# Altium schematic sheet WL-RF-BPF.SchDoc
size A2 portrait; Address1: Address1; Address2: Address2; Address3: Address3; Address4: Address4; DocumentNumber: WOLF-RF_UNIT; SheetNumber: 2; Scale: 1:1; DocumentType: Схема электрическая принципиальная; FirstReferrence: АБВГ.123456.001
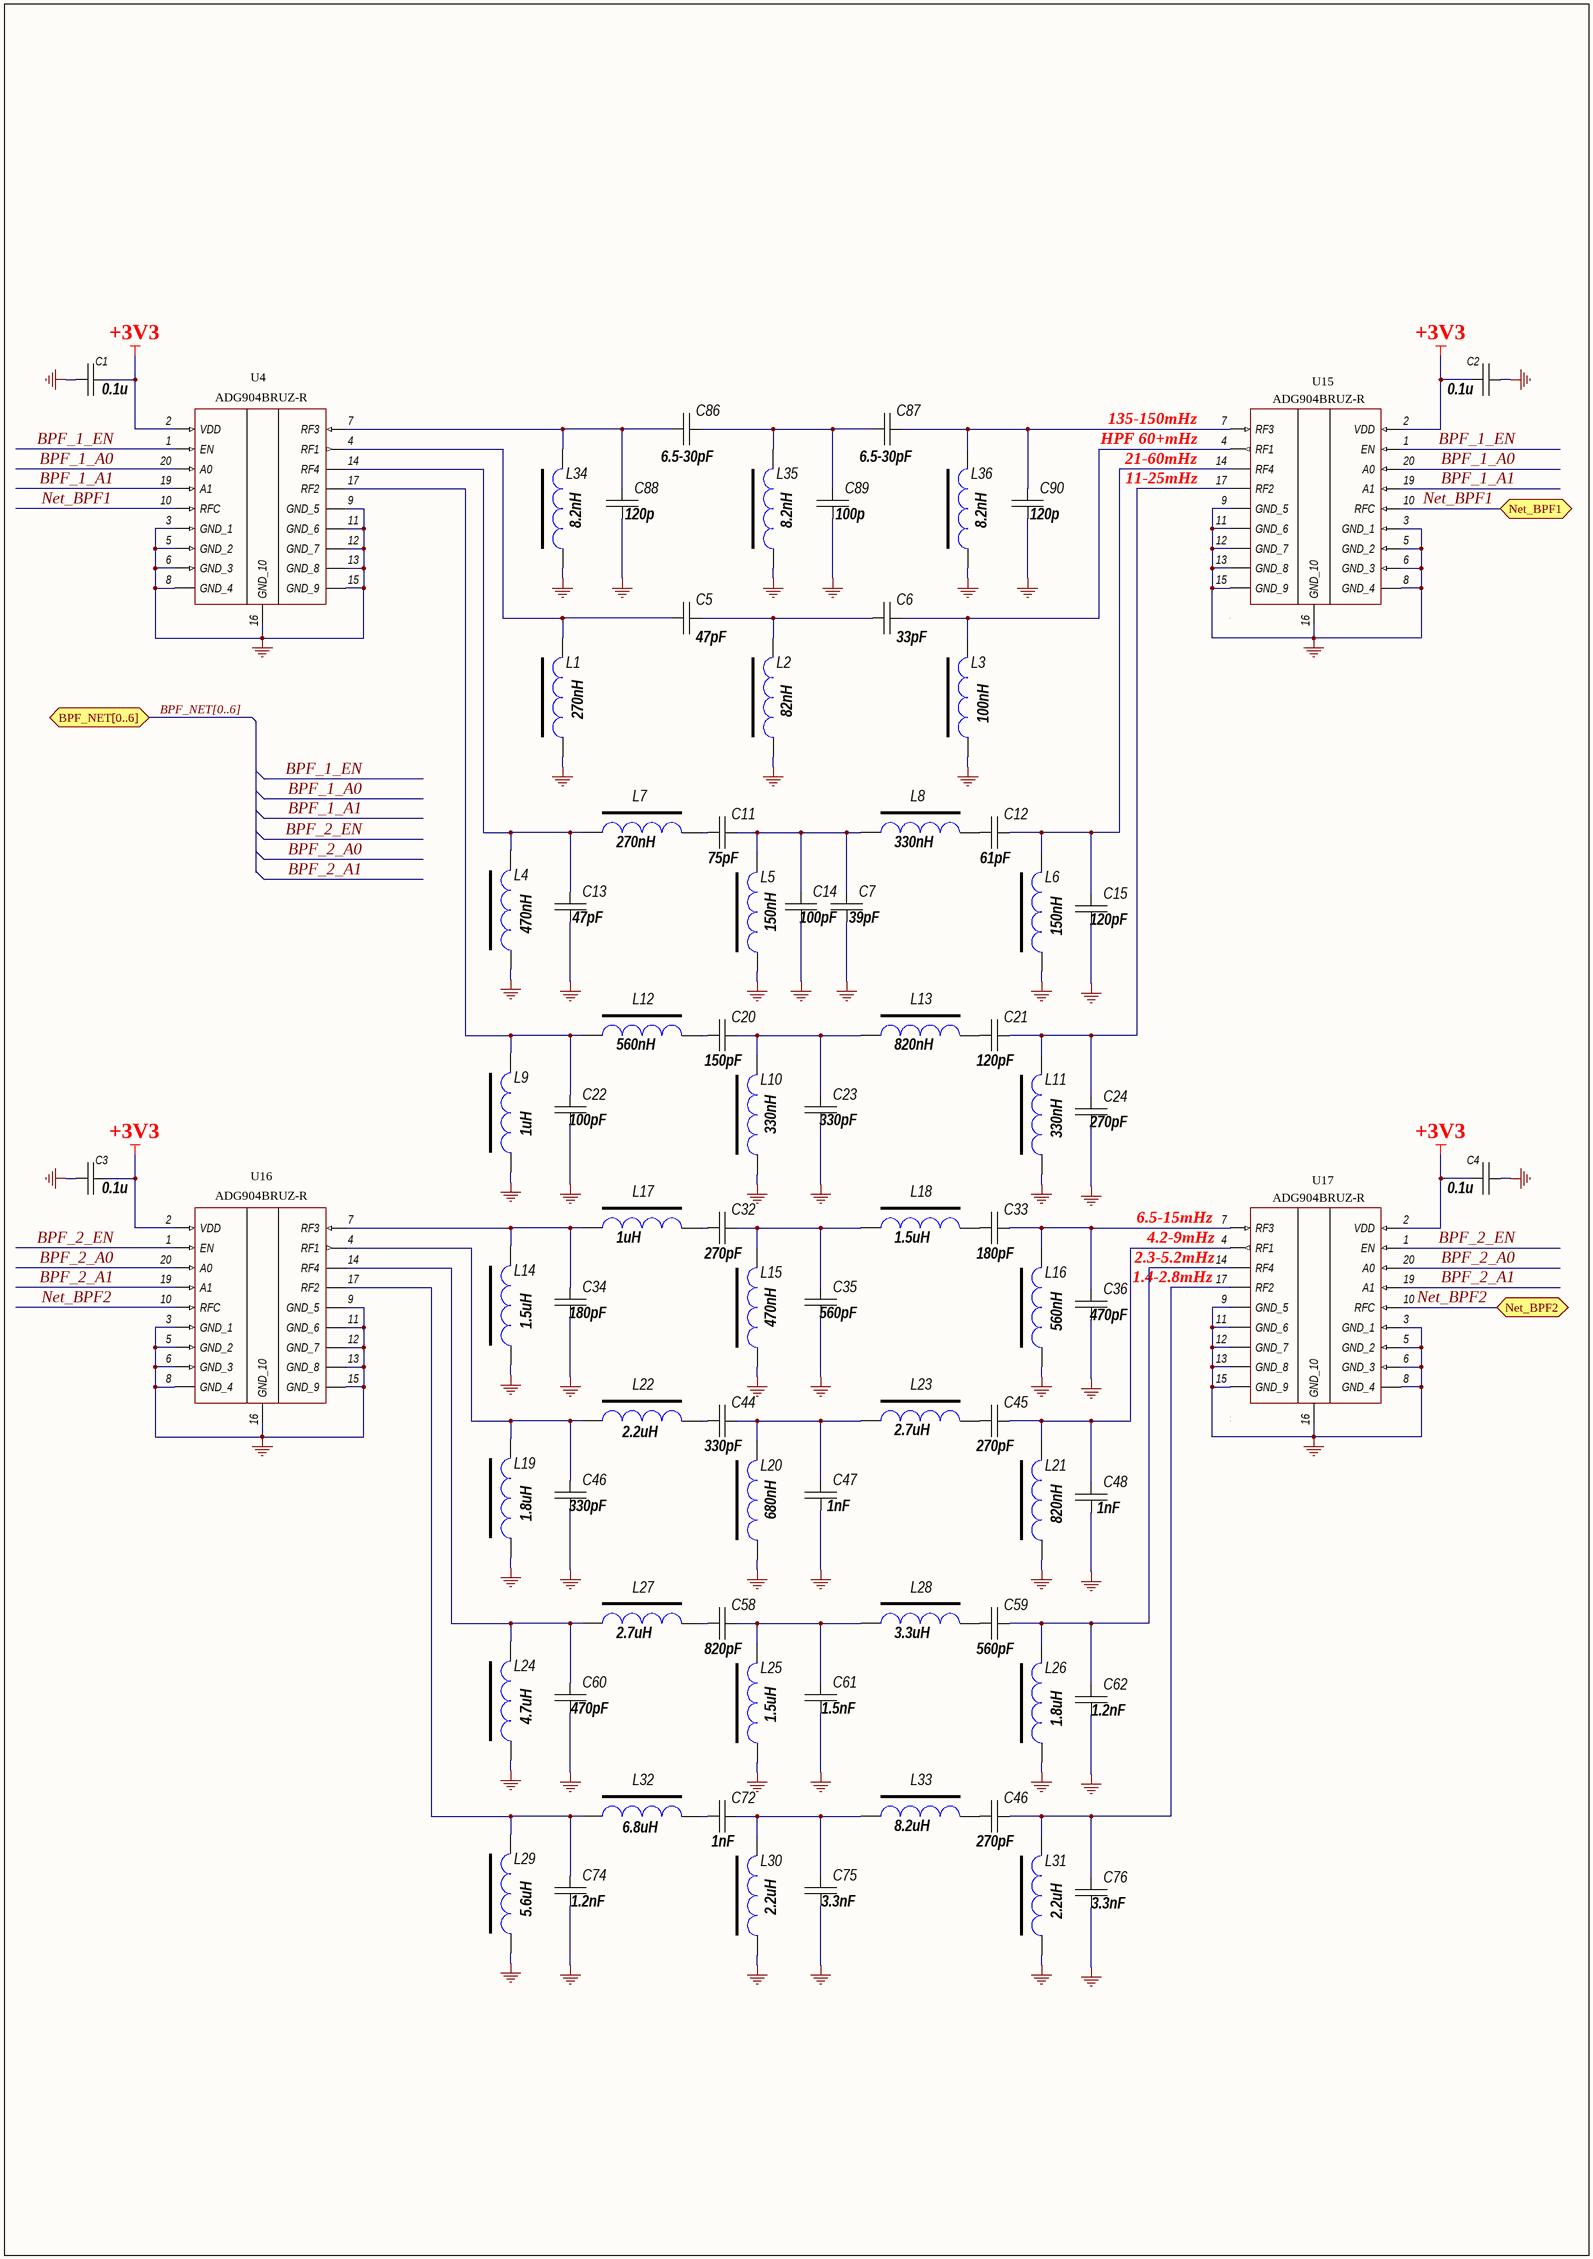
[diagram p0: WL-RF-BPF.SchDoc]

## Parts
(Parts that share a designator on the sheet are numbered #1, #2 ... from top to bottom, then left to right.)
C1  0.1u  [CH0201C]
C2  0.1u  [CH0201C]
C3  0.1u  [CH0201C]
C4  0.1u  [CH0201C]
C5  47pF  [CH0805C]
C6  33pF  [CH0805C]
C7  39pF  [CH0805C]
C11  75pF  [CH0805C]
C12  61pF  [CH0805C]
C13  47pF  [CH0805C]
C14  100pF  [CH0805C]
C15  120pF  [CH0805C]
C20  150pF  [CH0805C]
C21  120pF  [CH0805C]
C22  100pF  [CH0805C]
C23  330pF  [CH0805C]
C24  270pF  [CH0805C]
C32  270pF  [CH0805C]
C33  180pF  [CH0805C]
C34  180pF  [CH0805C]
C35  560pF  [CH0805C]
C36  470pF  [CH0805C]
C44  330pF  [CH0805C]
C45  270pF  [CH0805C]
C46#1  330pF  [CH0805C]
C46#2  270pF  [CH0805C]
C47  1nF  [CH0805C]
C48  1nF  [CH0805C]
C58  820pF  [CH0805C]
C59  560pF  [CH0805C]
C60  470pF  [CH0805C]
C61  1.5nF  [CH0805C]
C62  1.2nF  [CH0805C]
C72  1nF  [CH0805C]
C74  1.2nF  [CH0805C]
C75  3.3nF  [CH0805C]
C76  3.3nF  [CH0805C]
C86  6.5-30pF  [CH0805C]
C87  6.5-30pF  [CH0805C]
C88  120p  [CH0805C]
C89  100p  [CH0805C]
C90  120p  [CH0805C]
L1  270nH  [L1210]
L2  82nH  [L1210]
L3  100nH  [L1210]
L4  470nH  [L1210]
L5  150nH  [L1210]
L6  150nH  [L1210]
L7  270nH  [L1210]
L8  330nH  [L1210]
L9  1uH  [L1210]
L10  330nH  [L1210]
L11  330nH  [L1210]
L12  560nH  [L1210]
L13  820nH  [L1210]
L14  1.5uH  [L1210]
L15  470nH  [L1210]
L16  560nH  [L1210]
L17  1uH  [L1210]
L18  1.5uH  [L1210]
L19  1.8uH  [L1210]
L20  680nH  [L1210]
L21  820nH  [L1210]
L22  2.2uH  [L1210]
L23  2.7uH  [L1210]
L24  4.7uH  [L1210]
L25  1.5uH  [L1210]
L26  1.8uH  [L1210]
L27  2.7uH  [L1210]
L28  3.3uH  [L1210]
L29  5.6uH  [L1210]
L30  2.2uH  [L1210]
L31  2.2uH  [L1210]
L32  6.8uH  [L1210]
L33  8.2uH  [L1210]
L34  8.2nH  [L1210]
L35  8.2nH  [L1210]
L36  8.2nH  [L1210]
U4  ADG904BRUZ-R  [20-SOIC (W)]
U15  ADG904BRUZ-R  [20-SOIC (W)]
U16  ADG904BRUZ-R  [20-SOIC (W)]
U17  ADG904BRUZ-R  [20-SOIC (W)]

## Ports
BPF_NET[0..6] (bidir), Net_BPF1 (bidir), Net_BPF2 (bidir)

## Nets
+3V3: C1.1 C2.1 C3.1 C4.1 U4.2(VDD) U15.2(VDD) U16.2(VDD) U17.2(VDD)
GND: C1.2 C2.2 C3.2 C4.2 C7.1 C13.1 C14.1 C15.1 C22.1 C23.1 C24.1 C34.1 C35.1 C36.1 C46#1.1 C47.1 C48.1 C60.1 C61.1 C62.1 C74.1 C75.1 C76.1 C88.1 C89.1 C90.1 L1.1 L2.1 L3.1 L4.1 L5.1 L6.1 L9.1 L10.1 L11.1 L14.1 L15.1 L16.1 L19.1 L20.1 L21.1 L24.1 L25.1 L26.1 L29.1 L30.1 L31.1 L34.1 L35.1 L36.1 U4.3(GND_1) U4.5(GND_2) U4.6(GND_3) U4.8(GND_4) U4.9(GND_5) U4.11(GND_6) U4.12(GND_7) U4.13(GND_8) U4.15(GND_9) U4.16(GND_10) U15.3(GND_1) U15.5(GND_2) U15.6(GND_3) U15.8(GND_4) U15.9(GND_5) U15.11(GND_6) U15.12(GND_7) U15.13(GND_8) U15.15(GND_9) U15.16(GND_10) U16.3(GND_1) U16.5(GND_2) U16.6(GND_3) U16.8(GND_4) U16.9(GND_5) U16.11(GND_6) U16.12(GND_7) U16.13(GND_8) U16.15(GND_9) U16.16(GND_10) U17.3(GND_1) U17.5(GND_2) U17.6(GND_3) U17.8(GND_4) U17.9(GND_5) U17.11(GND_6) U17.12(GND_7) U17.13(GND_8) U17.15(GND_9) U17.16(GND_10)
1.4-2.8mHz: C46#2.2 C76.2 L31.2 U17.17(RF2)
2.3-5.2mHz: C59.2 C62.2 L26.2 U17.14(RF4)
4.2-9mHz: C45.2 C48.2 L21.2 U17.4(RF1)
6.5-15mHz: C33.2 C36.2 L16.2 U17.7(RF3)
11-25mHz: C21.2 C24.2 L11.2 U15.17(RF2)
21-60mHz: C12.2 C15.2 L6.2 U15.14(RF4)
135-150mHz: C87.2 C90.2 L36.2 U15.7(RF3)
BPF_1_A0: U4.20(A0) U15.20(A0)
BPF_1_A1: U4.19(A1) U15.19(A1)
BPF_1_EN: U4.1(EN) U15.1(EN)
BPF_2_A0: U16.20(A0) U17.20(A0)
BPF_2_A1: U16.19(A1) U17.19(A1)
BPF_2_EN: U16.1(EN) U17.1(EN)
HPF 60+mHz: C6.2 L3.2 U15.4(RF1)
Net_BPF1: U4.10(RFC) U15.10(RFC) ; port Net_BPF1
Net_BPF2: U16.10(RFC) U17.10(RFC) ; port Net_BPF2
NetC5_1: C5.1 L1.2 U4.4(RF1)
NetC5_2: C5.2 C6.1 L2.2
NetC7_2: C7.2 C11.2 C14.2 L5.2 L8.1
NetC11_1: C11.1 L7.2
NetC12_1: C12.1 L8.2
NetC13_2: C13.2 L4.2 L7.1 U4.14(RF4)
NetC20_1: C20.1 L12.2
NetC20_2: C20.2 C23.2 L10.2 L13.1
NetC21_1: C21.1 L13.2
NetC22_2: C22.2 L9.2 L12.1 U4.17(RF2)
NetC32_1: C32.1 L17.2
NetC32_2: C32.2 C35.2 L15.2 L18.1
NetC33_1: C33.1 L18.2
NetC34_2: C34.2 L14.2 L17.1 U16.7(RF3)
NetC44_1: C44.1 L22.2
NetC44_2: C44.2 C47.2 L20.2 L23.1
NetC45_1: C45.1 L23.2
NetC46#1_2: C46#1.2 L19.2 L22.1 U16.4(RF1)
NetC46#2_1: C46#2.1 L33.2
NetC58_1: C58.1 L27.2
NetC58_2: C58.2 C61.2 L25.2 L28.1
NetC59_1: C59.1 L28.2
NetC60_2: C60.2 L24.2 L27.1 U16.14(RF4)
NetC72_1: C72.1 L32.2
NetC72_2: C72.2 C75.2 L30.2 L33.1
NetC74_2: C74.2 L29.2 L32.1 U16.17(RF2)
NetC86_1: C86.1 C88.2 L34.2 U4.7(RF3)
NetC86_2: C86.2 C87.1 C89.2 L35.2

## Buses and harness runs
bus BPF_NET[0..6] = port BPF_NET[0..6]

## Notes on the sheet
- Title
- Size:
- Date:
- File:
- A2
- Number:
- Time:
- Revision:
- Sheet
- of

## Library data of the parts
C1-C7 C11-C15 C20-C24 C32-C36 C44 C45 C46#1 C46#2 C47 C48 C58-C62 C72 C74-C76 C86-C90 = Capacitor: Manufacturer: *; Model: *; HelpURL: *; ComponentKind: *; Value: *
L1-L36 = TRANS